# Altium schematic sheet POWER_2.SchDoc
size 420 x 297 mm; SheetNumber: 6; SheetTotal: 19
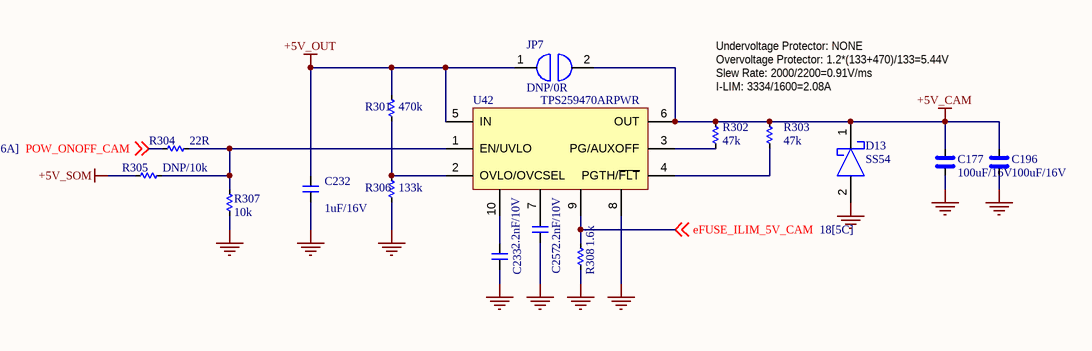
[diagram p0: POWER_2.SchDoc]

## Parts
C177  100uF/16V  [CAP_C_3225X80]
C196  100uF/16V  [CAP_C_3225X80]
C232  1uF/16V  [CAP_C_1005X60]
C233  2.2nF/10V  [CAP_C_1005X60]
C257  2.2nF/10V  [CAP_C_1005X60]
D13  SS54  [DO-214AC_SMA]
JP7  DNP/0R  [RES_C_1608X60]
R301  470k  [RES_C_1005X40]
R302  47k  [RES_C_1005X40]
R303  47k  [RES_C_1005X40]
R304  22R  [RES_C_1005X40]
R305  DNP/10k  [RES_C_1005X40]
R306  133k  [RES_C_1005X40]
R307  10k  [RES_C_1005X40]
R308  1.6k  [RES_C_1005X40]
U42  TPS259470ARPWR  [VQFN-HR-10]

## Nets
+5V_CAM: C177.2 C196.2 D13.1 JP7.2 R302.2 R303.2 U42.6(OUT)
+5V_OUT: C232.2 JP7.1 R301.2 U42.5(IN)
+5V_SOM: R305.2
GND: C177.1 C196.1 C232.1 C233.1 C257.1 D13.2 R306.1 R307.2 R308.1 U42.8
eFUSE_ILIM_5V_CAM: R308.2 U42.9 ; off-sheet eFUSE_ILIM_5V_CAM
POW_ONOFF_CAM: R304.2 ; off-sheet POW_ONOFF_CAM
NetC233_2: C233.2 U42.10
NetC257_2: C257.2 U42.7
NetR301_1: R301.1 R306.2 U42.2(OVLO/OVCSEL)
NetR302_1: R302.1 U42.3(PG/AUXOFF)
NetR303_1: R303.1 U42.4(PGTH/~{FLT})
NetR304_1: R304.1 R305.1 R307.1 U42.1(EN/UVLO)

## Notes on the sheet
- Undervoltage Protector: NONE
- Overvoltage Protector: 1.2*(133+470)/133=5.44V
- Slew Rate: 2000/2200=0.91V/ms
- I-LIM: 3334/1600=2.08A
- Project:
- Sub-system:
- Design by:
- Sheet title:
- Sheet
- of
- Checked by:
- Approved by:
- Revision:
- Document No:
- Size:
- Date:
- A3

## Library data of the parts
C177 C196 = _CAP_C_High_2: CAP CHIP High Value
C232 C233 C257 = _CAP_C_2: CAP CHIP
D13 = SS54: DIODE SCHOTTKY 60V 3A DO214AA
JP7 = JUMPER
R301-R308 = _RES_B_2: RES